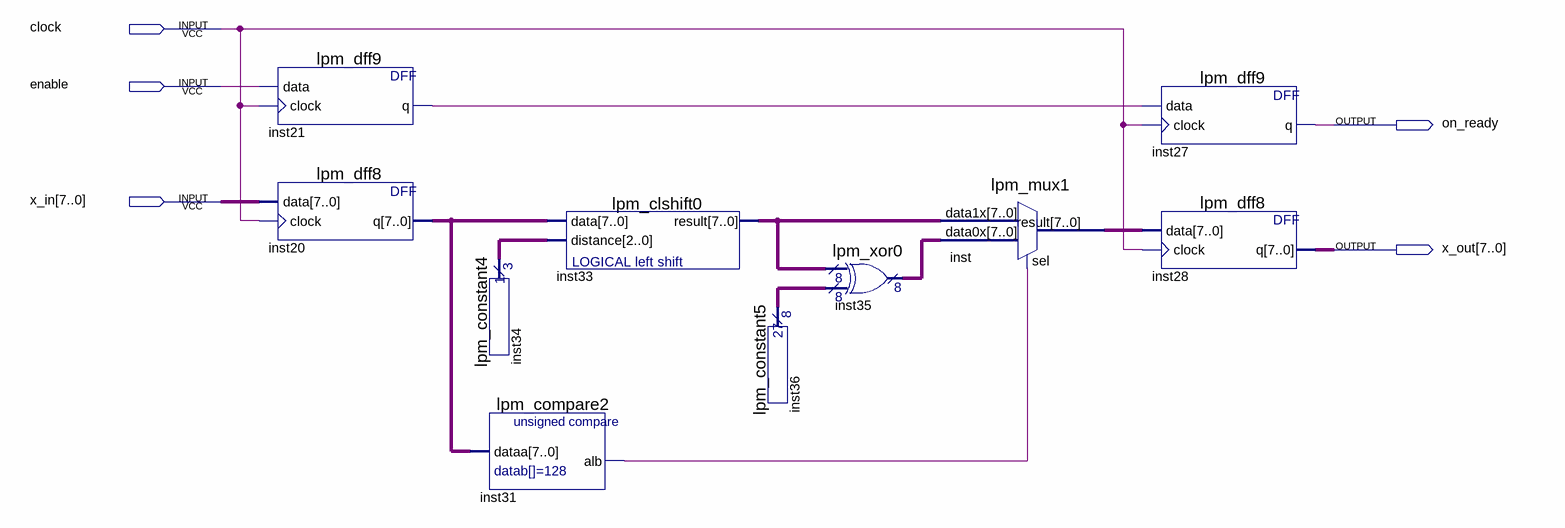
[diagram p0: schematic sheet]
// Quartus schematic mul02.bdf as structural Verilog: 10 symbols, 5 pins
module mul02 (
  input  clock,
  input  enable,
  input  [7:0] x_in,
  output on_ready,
  output [7:0] x_out
);

  wire inst21_q, inst31_alb;
  wire [2:0] inst34_result;
  wire [7:0] inst20_q, inst33_result, inst35_result, inst36_result, inst_result;

  lpm_dff9 inst21 (.data(enable), .clock(clock), .q(inst21_q));
  lpm_dff8 inst20 (.data(x_in), .clock(clock), .q(inst20_q));
  lpm_constant4 inst34 (.result(inst34_result));
  lpm_compare2 inst31 (.dataa(inst20_q), .alb(inst31_alb));
  lpm_clshift0 inst33 (.data(inst20_q), .distance(inst34_result), .result(inst33_result));
  lpm_constant5 inst36 (.result(inst36_result));
  lpm_xor0 inst35 (.data0x(inst33_result), .data1x(inst36_result), .result(inst35_result));
  lpm_mux1 inst (.data1x(inst33_result), .data0x(inst35_result), .sel(inst31_alb), .result(inst_result));
  lpm_dff9 inst27 (.data(inst21_q), .clock(clock), .q(on_ready));
  lpm_dff8 inst28 (.data(inst_result), .clock(clock), .q(x_out));
endmodule
